# EasyEDA Pro project nice_view_dongle.epro

# Schematic dongle
Board Name: Dongle; Create Date: 2025-03-17; Page Name: dongle; Project Name: Velvet_v3; Schematic Name: dongle; Update Date: 2025-03-17; Company: EasyEDA.com; Drawn: EasyEDA; Page Size: A4; Part Number: JLCPCB-002; Reviewed: EasyEDA; Version: V0.1
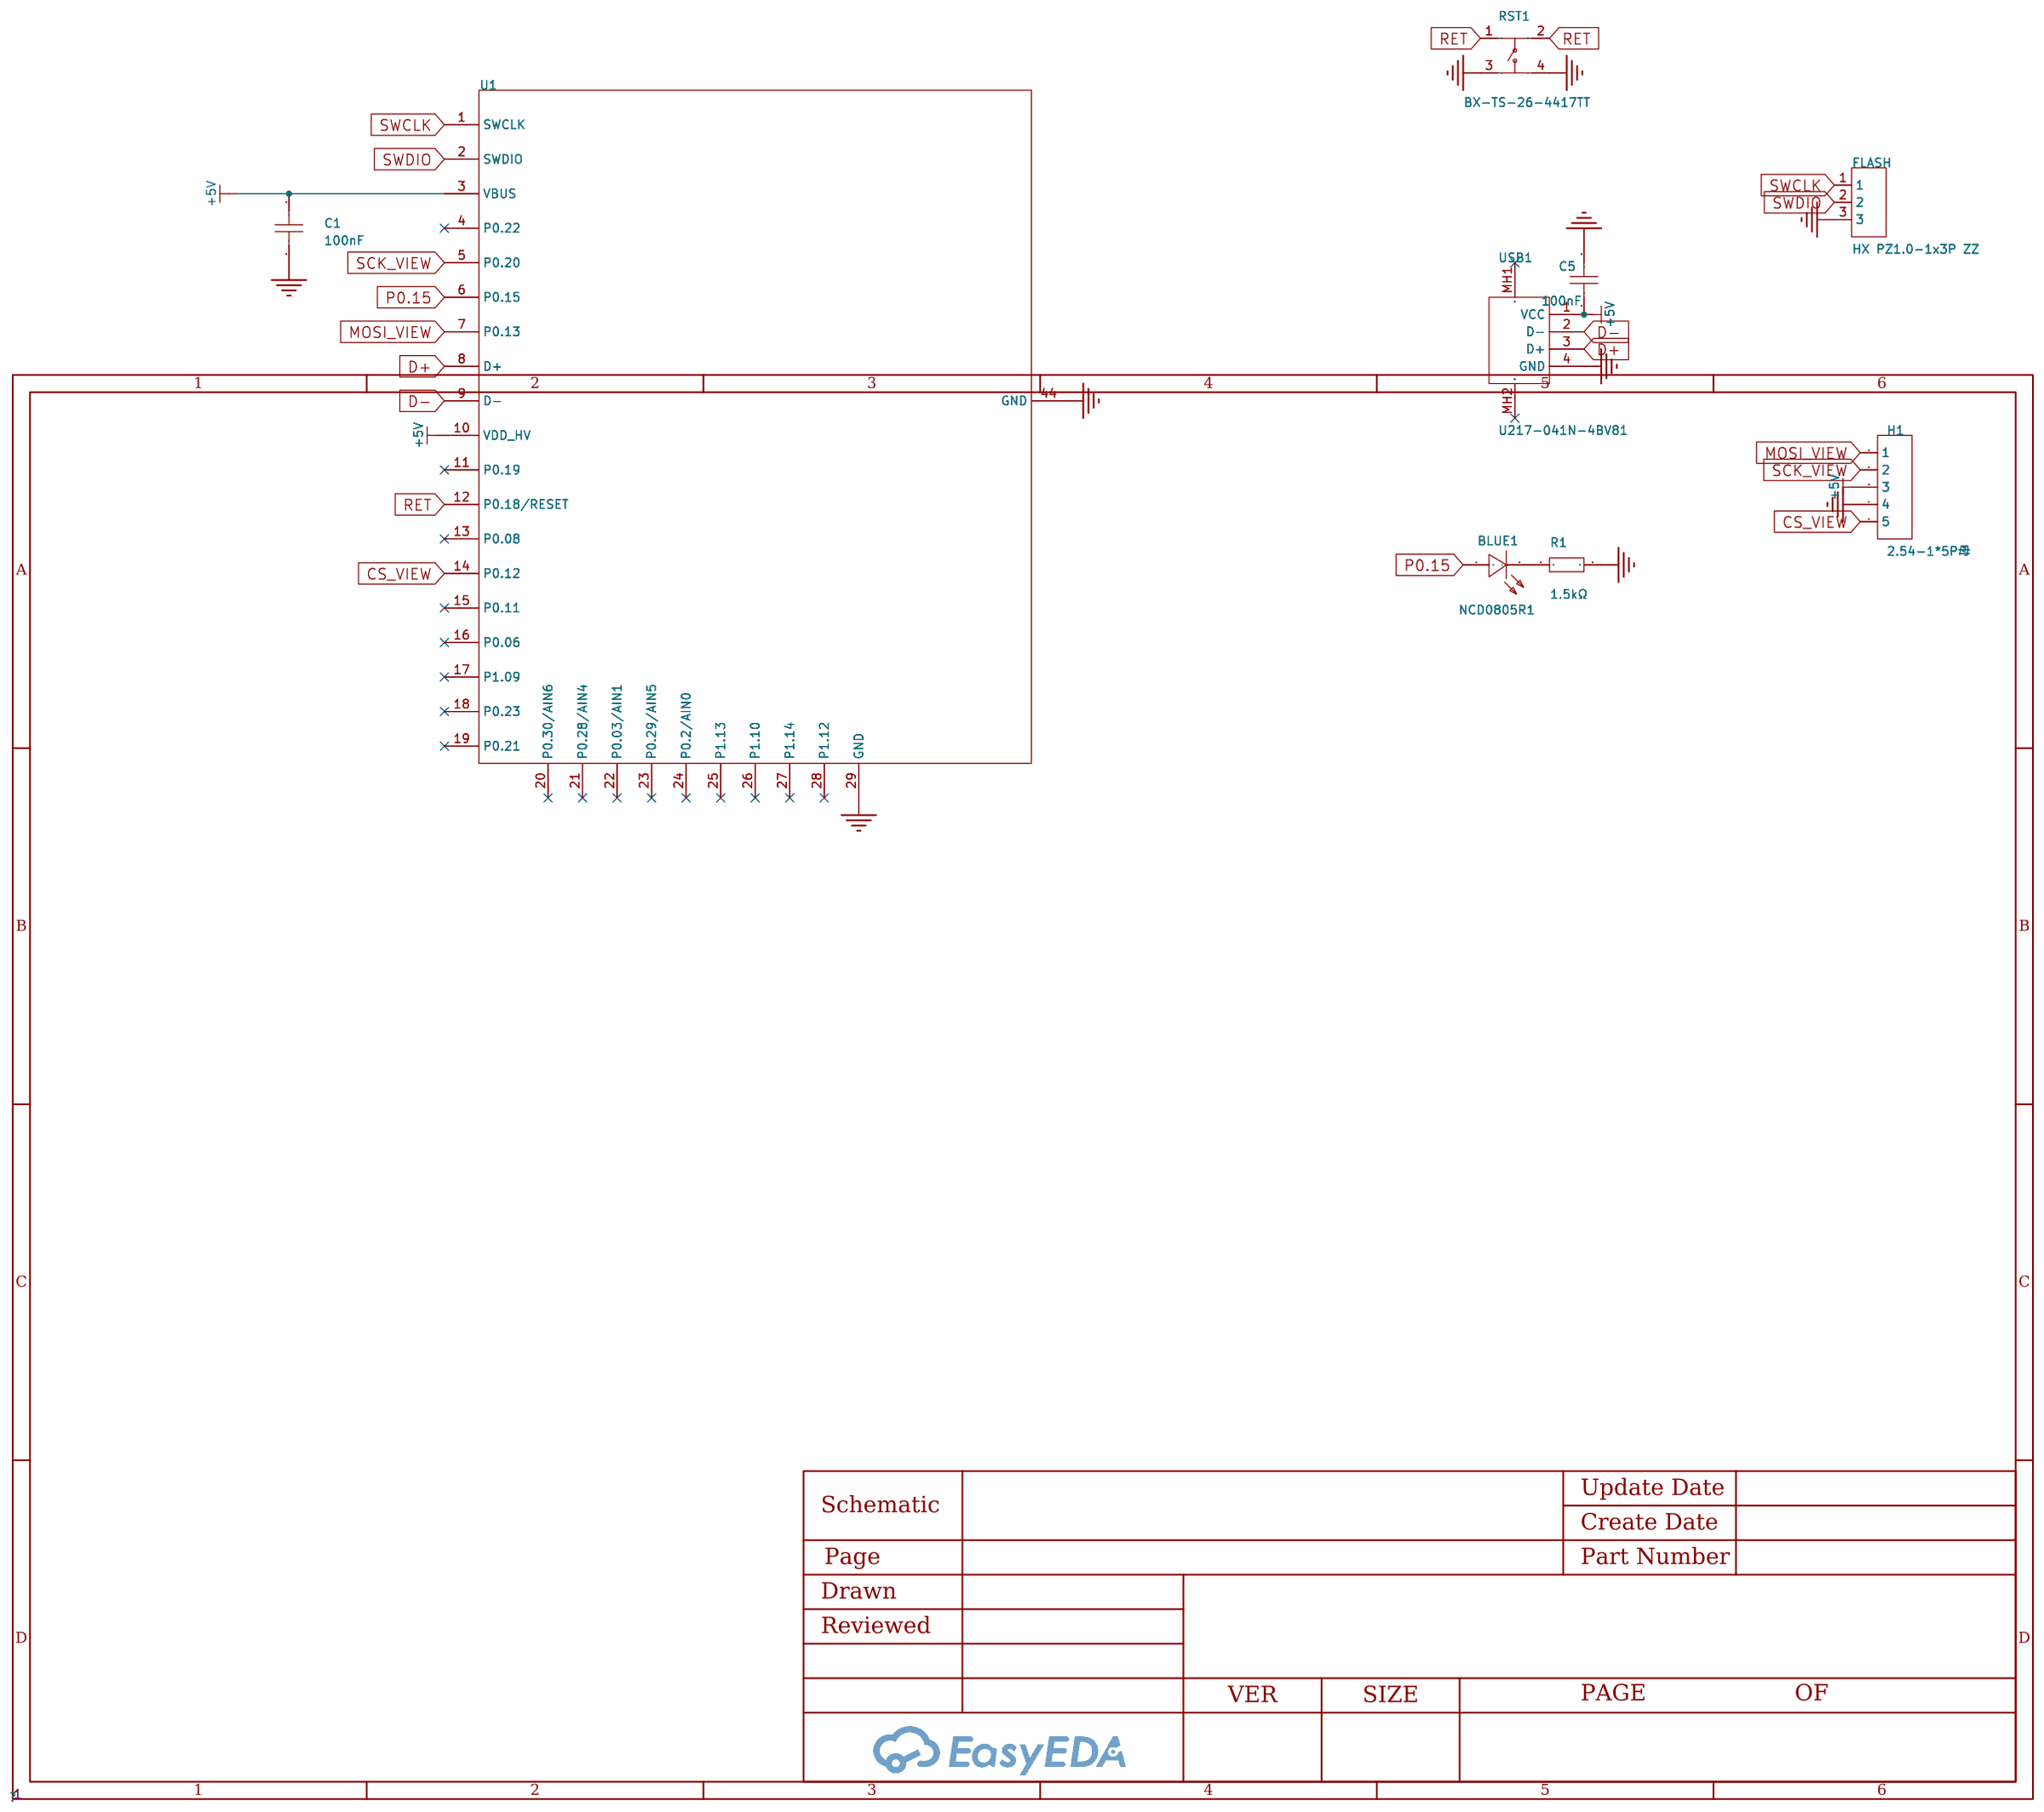
[diagram p0: schematic sheet]

## Parts
BLUE1  NCD0805R1  [LED0805-R-RD]
C1  100nF  [C0603]
C5  100nF  [C0603]
FLASH  HX PZ1.0-1x3P ZZ  [CONN-TH_HX-PZ1.0-1X3P-ZZ]
H1  2.54-1*5P母  [HDR-TH_5P-P2.54-V-F]
R1  1.5kΩ  [R1206]
RST1  BX-TS-26-4417TT  [SW-SMD_4P-L5.2-W5.2-P3.70-LS6.5]
U1  N52840  [52840MICRO-v1]
USB1  U217-041N-4BV81  [USB-A-SMD_U217-041N-4BV81]

## Library data of the parts
BLUE1 = NCD0805R1: 灯头类型:-;发光颜色:红色;正向电压(VF):1.6V~2.6V;功率:65mW;正向电流:20mA;主波长:615nm~630nm;二极管配置:独立二极管;透镜颜色:无色透明透镜;色温:-;发光强度:67mcd~195mcd;发光角度:130°;载带方式:-;工作温度:-30℃~+85℃;; Supplier Part: C84256; Manufacturer: 国星光电; Supplier Footprint: 0805; JLCPCB Part Class: 基础库; Datasheet: https://atta.szlcsc.com/upload/public/pdf/source/20200820/C84256_F0A75A43B3EAD75808600A0514C76B99.pdf; Supplier: LCSC; Emitted Color: 红色; Forward Voltage (VF): 1.6V~2.6V; Power Dissipation: 65mW; Forward Current: 20mA; Dominant Wavelength: 615nm~630nm; Diode Configuration: 独立二极管; Lens Color: 无色透明透镜; Luminous Intensity: 67mcd~195mcd; Viewing Angle: 130°; Operating Temperature: -30℃~+85℃
C1 = CAP_0603: Supplier Footprint: 0603
C5 = CGA0603X7R104K500JT: 容值:100nF;精度:±10%;额定电压:50V;材质(温度系数):X7R;; LCSC Part Name: 100nF ±10% 50V; Supplier Part: C6119867; Manufacturer: HRE(芯声); Supplier Footprint: 0603; JLCPCB Part Class: Extended Part; Supplier: LCSC; Tolerance: ±10%; Voltage Rated: 50V; Temperature Coefficient: X7R
FLASH = HX PZ1.0-1x3P ZZ: 插针结构:1x3P;间距:1mm;行距:-;圆针/方针:方针;安装方式:直插;排数:单排;总PIN位数:3P;额定电流:750mA;额定电压:-;配合针长度:2mm;塑高:1mm;端接针长度:2mm;触头材质:磷青铜;触头镀层:金;工作温度:-40℃~+105℃;颜色:黑色;; LCSC Part Name: 1x3P 间距:1mm 方针 直插; Supplier Part: C22438171; Manufacturer: hanxia(韩下); Supplier Footprint: 插件,P=1mm; JLCPCB Part Class: Extended Part; Datasheet: https://atta.szlcsc.com/upload/public/pdf/source/20240522/0E6E3AB177DECE2543461AA88271EA17.pdf; Supplier: LCSC; Pin Structure: 1x3P; Pitch: 1mm; Circluar Pins/Square Pins: 方针; Mounting Type: 直插; Number of Rows: 单排; Number of Pins: 3P; Current Rating: 750mA; Length of Mating Pin: 2mm; Insulation Height: 1mm; Length of End Connection Pin: 2mm; Contact Material: 磷青铜; Contact Plating: 金; Operating Temperature: -40℃~+105℃; Color: 黑色
H1 = 2.54-1*5P母: 插孔结构:1x5P;间距:2.54mm;行距:-;安装类型:直插;排数:单排;总孔位数:5P;塑高:-;触头材质:-;触头镀层:-;; LCSC Part Name: 间距:2.54mm 1x5P 直插; Supplier Part: C50950; Manufacturer: BOOMELE(博穆精密); Supplier Footprint: 插件,P=2.54mm; JLCPCB Part Class: 扩展库; Datasheet: https://atta.szlcsc.com/upload/public/pdf/source/20210301/C2718488_F4427B881E42CAA8DDB0B1C12B3A522C.pdf; Supplier: LCSC; Holes Structure: 1x5P; Pitch: 2.54mm; Mounting Type: 直插; Number of Rows: 单排; Number of Holes: 5P
R1 = FRC1206J152 TS: 电阻类型:厚膜电阻;阻值:1.5kΩ;精度:±5%;功率:250mW;最大工作电压:200V;温度系数:±100ppm/℃;; LCSC Part Name: 1.5kΩ ±5% 250mW 厚膜电阻; Supplier Part: C2907413; Manufacturer: FOJAN(富捷); Supplier Footprint: 1206; JLCPCB Part Class: Extended Part; Datasheet: https://atta.szlcsc.com/upload/public/pdf/source/20211221/925EC7D7225764EE0046F22065062C87.pdf; Supplier: LCSC; Type: 厚膜电阻; Tolerance: ±5%; Power(Watts): 250mW; Overload Voltage (Max): 200V; Temperature Coefficient: ±100ppm/℃; Operating Temperature Range: -55℃~+155℃
RST1 = BX-TS-26-4417TT: 电路结构:单刀单掷;按钮形状:圆形按钮;作用力:260gf;安装方式:立贴;开关长度:4mm;开关宽度:4mm;开关高度:1.7mm;带支架:不带;触点电流:50mA;额定电压(AC):250V;额定电压(DC):12V;绝缘电阻:100MΩ;机械寿命:10万次;; LCSC Part Name: 4x4x1.7铜头开关; Supplier Part: C18078110; Manufacturer: Bossie(博锡); Supplier Footprint: SMD-4P,4x4mm; Datasheet: https://atta.szlcsc.com/upload/public/pdf/source/20231017/916BF7A8DB1936A62562F9A253B59526.pdf; Supplier: LCSC; Circuit: 单刀单掷; Actuator Style: 圆形按钮; Operating Force: 260gf; Mounting Style: 立贴; Switch Length: 4mm; Switch Width: 4mm; Switch Height: 1.7mm; Strike Gundam: 不带; Contact Current: 50mA; Voltage Rating (AC): 250V; Voltage Rating (DC): 12V; Insulation Resistance: 100MΩ; Actuator/Cap Color: 金色; Pin Style: 鸥翼型; Mechanical Life: 10万次; Operating Temperature: -30℃~+80℃
U1 = 52840micro_v1
USB1 = U217-041N-4BV81: 连接器类型:Type-A;标准:-;公母:公;安装方式:-;触点数量:4P;端口数量:1;额定电流 - 电源:1.5A;触头材质:黄铜;触头镀层:金;工作温度范围:-40℃~+85℃;焊接温度(最大值):-;; LCSC Part Name: Type-A 公; Supplier Part: C319178; Manufacturer: XKB Connection(中国星坤); Supplier Footprint: SMD; JLCPCB Part Class: Extended Part; Datasheet: https://atta.szlcsc.com/upload/public/pdf/source/20211015/D42E73CBE112FBE216C7DAC502068881.pdf; Supplier: LCSC; Connector Type: Type-A; Gender: 公; Number of Ports: 1; Number of Contacts: 4P; Current Rating - Power (Max): 1.5A; Contact Material: 黄铜; Contact Plating: 金; Operating Temperature Range: -40℃~+85℃

## Nets
+5V: C1.2 C5.1 H1.3 U1.3(VBUS) U1.10(VDD_HV) USB1.1(VCC)
GND: C1.1 C5.2 FLASH.3 H1.4 R1.2 RST1.3 RST1.4 U1.29(GND) U1.44(GND) USB1.4(GND)
CS_VIEW: H1.5 U1.14(P0.12)
D+: U1.8(D+) USB1.3(D+)
D-: U1.9(D-) USB1.2(D-)
MOSI_VIEW: H1.1 U1.7(P0.13)
P0.15: BLUE1.1(+) U1.6(P0.15)
RET: RST1.1 RST1.2 U1.12(P0.18/RESET)
SCK_VIEW: H1.2 U1.5(P0.20)
SWCLK: FLASH.1 U1.1(SWCLK)
SWDIO: FLASH.2 U1.2(SWDIO)
$1N985: BLUE1.2(-) R1.1

Not connected (* = marked no-connect by the designer): U1 4(P0.22)* 11(P0.19)* 13(P0.08)* 15(P0.11)* 16(P0.06)* 17(P1.09)* 18(P0.23)* 19(P0.21)* 20(P0.30/AIN6)* 21(P0.28/AIN4)* 22(P0.03/AIN1)* 23(P0.29/AIN5)* 24(P0.2/AIN0)* 25(P1.13)* 26(P1.10)* 27(P1.14)* 28(P1.12)*; USB1 MH1* MH2*

# Board dongle
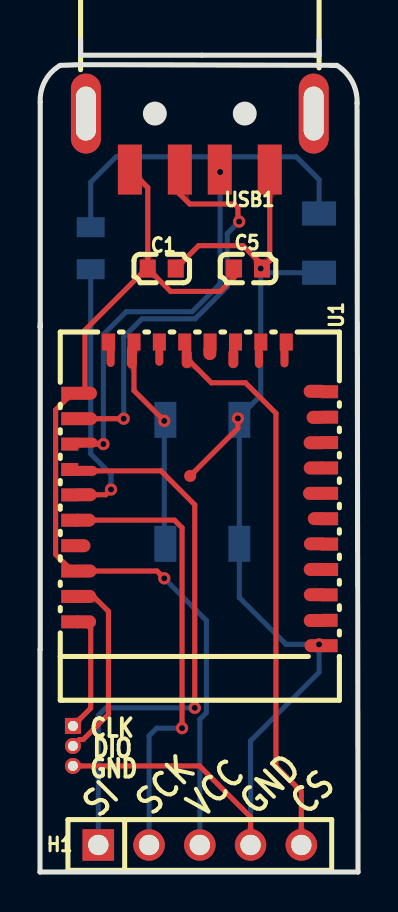
[diagram p1: board, top side]
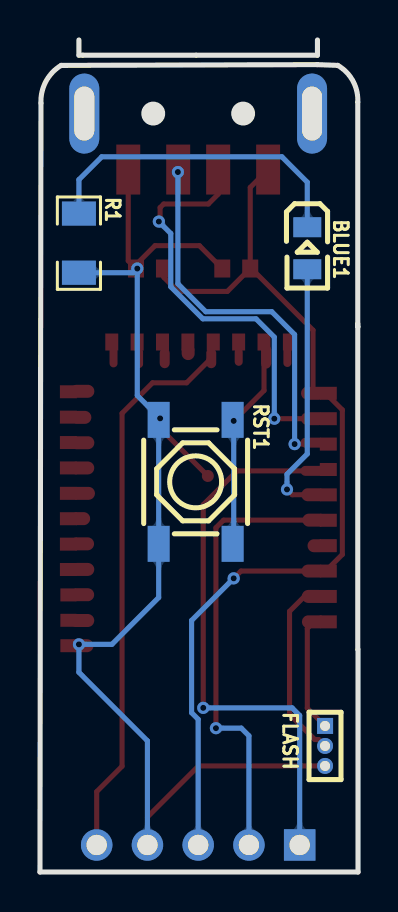
[diagram p2: board, bottom side, seen from below]

Outline 15.92 x 41.61 mm; copper layers: Top Layer, Bottom Layer. Coordinates in mm from the lower left corner of the outline.
Outline path: 0,11.13 0,0 15.92,0 15.87,38.45 arc(15.63,39.53) 14.86,40.34 2.03,40.38 1.02,40.34 arc(0.26,39.56) 0.01,38.5 0.01,27.27 0,27.26 ; 0.01,27.44 0.01,11.13
Stack: Top Layer 0.035mm / Dielectric1 1.51mm FR4 er 4.5 / Bottom Layer 0.035mm

## Design rules (mm)
template: JLCPCB Capability(Two Layers Board)
spacing copperThickness1oz (default): track to track 0.102, other pairs 0.152 to 0.3
spacing copperThickness2oz: track to track 0.203, other pairs 0.152 to 0.3
track width copperThickness1oz (default): min 0.127, default 0.254, max 2.54
track width copperThickness2oz: min 0.203, default 0.254, max 2.54
differential pair differentialPair (default): width min 0.127, default 0.254, max 2.54; gap min 0.152, default 0.152
via viaSize (default): diameter min 0.5, default 0.61, max 10; hole min 0.3, default 0.305, max 6.3

## Placement (name value [footprint] x y rotation side)
BLUE1  NCD0805R1  [LED0805-R-RD]  2.54 31.2 270 bottom
C1  100nF  [C0603]  6.1 30.18 180 top
C5  100nF  [C0603]  10.41 30.18 0 top
FLASH  HX PZ1.0-1x3P ZZ  [CONN-TH_HX-PZ1.0-1X3P-ZZ]  1.65 6.3 270 bottom
H1  2.54-1*5P母  [HDR-TH_5P-P2.54-V-F]  8 1.35 0 top
R1  1.5kΩ  [R1206]  13.97 31.45 270 bottom
RST1  BX-TS-26-4417TT  [SW-SMD_4P-L5.2-W5.2-P3.70-LS6.5]  8.13 19.51 270 bottom
U1  N52840  [52840MICRO-v1]  1.14 27.01 270 top
USB1  U217-041N-4BV81  [USB-A-SMD_U217-041N-4BV81]  8 36.53 180 top

## Footprints (pads in the part's own frame, mm; a bottom-side part is the same pattern mirrored in y, then rotated)
52840MICRO-v1
  oval 0.65x1.2 smd: 1(14.493,1.065) 2(13.223,1.07) 3(11.954,1.085) 5(9.409,1.04) 6(8.139,1.095) 9(4.333,1.109) 10(3.063,1.109) 19(2.963,12.655) 21(5.538,12.655) 22(6.798,12.66) 23(8.069,12.625) 25(10.594,12.67) 26(11.873,12.66) 27(13.139,12.665) 28(14.428,12.66) 29(15.688,12.7)
  rect 0.65x0.85 smd: 1(14.495,0.346) 2(13.225,0.346) 3(11.955,0.346) 4(10.685,0.346) 5(9.415,0.346) 6(8.145,0.346) 7(6.875,0.346) 8(5.605,0.346) 9(4.335,0.346) 10(3.065,0.346) 19(2.988,13.355) 20(4.258,13.355) 21(5.528,13.355) 22(6.798,13.355) 23(8.068,13.355) 24(9.338,13.355) 25(10.608,13.355) 26(11.878,13.355)
  oval 0.65x0.9 smd: 4(10.688,0.934)
  oval 0.5x1.2 smd: 7(6.944,1.135) 8(5.534,1.13)
  rect 0.85x0.65 smd: 11(0.501,2.293) 12(0.501,3.563) 13(0.501,4.833) 14(0.501,6.103) 15(0.501,7.373) 16(0.501,8.643) 17(0.501,9.913) 18(0.501,11.183)
  oval 1x0.4 smd: 11(1.248,2.394) 17(1.298,9.815) 18(1.268,11.095)
  oval 1.2x0.5 smd: 12(1.228,3.459)
  oval 0.9x0.4 smd: 13(1.239,4.83)
  oval 1x0.5 smd: 14(1.308,6.205) 16(1.308,8.534)
  oval 0.8x0.65 smd: 15(1.004,7.359)
  oval 0.65x1 smd: 20(4.269,12.705) 24(9.334,12.765)
  rect 0.65x0.8 smd: 27(13.148,13.355) 28(14.418,13.355) 29(15.688,13.355)
  round 0.6 smd: 44(7.199,6.375)
C0603
  rect 0.8x0.9 smd: 1(-0.7,0) 2(0.7,0)
CONN-TH_HX-PZ1.0-1X3P-ZZ
  rect 0.8x0.8 hole 0.5: 1(-1,0)
  round 0.8 hole 0.5: 2(0,0) 3(1,0)
HDR-TH_5P-P2.54-V-F
  rect 1.575x1.575 hole 1.02: 1(-5.08,0)
  round 1.575 hole 1.02: 2(-2.54,0) 3(0,0) 4(2.54,0) 5(5.08,0)
LED0805-R-RD
  rect 1x1.399 smd: 1(1.05,0) 2(-1.05,0)
R1206
  rect 1.208x1.701 smd: 1(-1.479,0) 2(1.479,0)
SW-SMD_4P-L5.2-W5.2-P3.70-LS6.5
  rect 1.8x1.1 smd: 1(-3.1,1.85) 2(3.1,1.85) 3(-3.1,-1.85) 4(3.1,-1.85)
USB-A-SMD_U217-041N-4BV81
  rect 1.2x2.5 smd: 1(3.5,1.4) 2(1,1.4) 3(-1,1.4) 4(-3.5,1.4)
  oval 1.5x4 hole 1x2.7: 5(-5.7,-1.4) 6(5.7,-1.4)

## Nets
As in the schematic.

Pads without a net: U1 4 11 13 15 16 17 18 19 20 21 22 23 24 25 26 27 28; USB1 5 6

## Via types
v1: diameter 0.61, hole 0.305, Top Layer to Bottom Layer, 12 vias

## Routing (per net, layer and track width the routed paths; a pad name or vN(x,y) marks a point on that pad's centre or on a via; arc(x,y) is an arc through that point)
+5V: length 46.4
  Top Layer w0.254: C1.2 5.4,34.24 4.5,35.13 ; C1.2 5.33,30.18 2.25,27.1 U1.10 ; C1.2 6.54,29.04 9.02,29.04 9.71,29.73 C5.1 ; U1.10 1.49,23.82 0.78,23.11 0.78,15.88 1.49,15.18 U1.3 ; v1(6.22,14.69) 5.86,15.05 U1.3
  Bottom Layer w0.254: v1(6.22,14.69) 8.33,12.58 8.33,7.97 8,7.64 H1.3
GND: length 62.3
  Top Layer w0.254: v1(11.05,30.18) C5.2 ; C5.2 11.5,30.57 11.5,35.13 ; C5.2 11.11,30.37 10.16,31.32 7.94,31.32 C1.1 ; v1(13.97,11.39) 13.9,11.32 U1.29 ; v1(9.91,22.69) 9.91,22.2 U1.44 ; FLASH.3 7.98,5.3 10.54,2.75 H1.4
  Bottom Layer w0.254: H1.4 10.54,6.56 13.97,9.99 v1(13.97,11.39) 12.32,11.39 9.98,13.73 RST1.3 9.98,22.62 v1(9.91,22.69) 11.05,23.83 v1(11.05,30.18) 11.26,29.97 R1.2
CS_VIEW: length 28.6
  Top Layer w0.254: 13.08,1.35 13.08,4.02 11.81,5.29 11.81,22.94 10.29,24.47 8.58,24.47 U1.14 7.35,26.4 U1.14
D+: length 19.8
  Top Layer w0.254: U1.8 v1(3.17,21.4) ; 9,35.13 9.02,35.11 v1(9.02,35.01)
  Bottom Layer w0.254: v1(3.17,21.4) 3.17,26.88 4.32,28.02 7.62,28.02 9.02,29.42 v1(9.02,35.01)
D-: length 21.7
  Top Layer w0.254: 7,35.13 7,33.9 7.49,33.41 9.73,33.41 9.91,33.23 9.91,32.59 v1(9.97,32.53) ; U1.9 U1.9 v1(4.19,22.67)
  Bottom Layer w0.254: v1(9.97,32.53) 9.37,31.93 9.37,29.27 7.77,27.67 5.1,27.67 4.19,26.75 v1(4.19,22.67)
MOSI_VIEW: length 27.8
  Top Layer w0.254: v1(7.75,8.21) 7.75,18.37 6.05,20.06 U1.7
  Bottom Layer w0.254: v1(7.75,8.21) 3.3,8.21 2.92,7.83 H1.1
P0.15: length 12.9
  Top Layer w0.254: v1(3.56,19.13) 3.29,18.87 U1.6
  Bottom Layer w0.254: v1(3.56,19.13) 3.56,19.89 2.54,20.91 BLUE1.1
RET: length 10.8
  Top Layer w0.254: v1(6.22,22.56) 4.71,24.08 U1.12
  Bottom Layer w0.254: 6.28,16.41 6.22,16.47 v1(6.22,22.56) 6.23,22.56 RST1.1
SCK_VIEW: length 22.4
  Top Layer w0.254: v1(7.11,7.19) 7.11,17.22 6.73,17.6 U1.5
  Bottom Layer w0.254: v1(7.11,7.19) 5.84,7.19 5.46,6.81 5.46,1.35
SWCLK: length 5.7
  Top Layer w0.254: U1.1 2.54,12.18 2.54,8.19 FLASH.1
SWDIO: length 9.1
  Top Layer w0.254: U1.2 2.68,13.78 3.43,13.04 3.43,7.89 2.17,6.63 1.97,6.63 FLASH.2
$1N985: length 16.4
  Bottom Layer w0.254: R1.1 13.97,34.63 12.83,35.77 3.81,35.77 2.54,34.5 BLUE1.2

## Copper pours and planes (outline as drawn; the poured copper is in the pictures)
GND on Top Layer: -2.16,41.74 18.29,41.74 18.29,-2.59 -2.16,-2.59
GND on Top Layer: -2.16,41.86 18.16,41.86 18.16,-2.59 -2.16,-2.59
GND on Bottom Layer: -2.16,41.74 18.29,41.74 18.29,-2.59 -2.16,-2.59

Small or netless copper shapes (teardrops, artwork), in the pictures only: 46 on Top Layer, 28 on Bottom Layer

## Text on the board
Top Silkscreen Layer: CLK | GND | DIO | SI | SCK | VCC | CS
